# Altium schematic sheet buffers_5bits.SchDoc
size A4
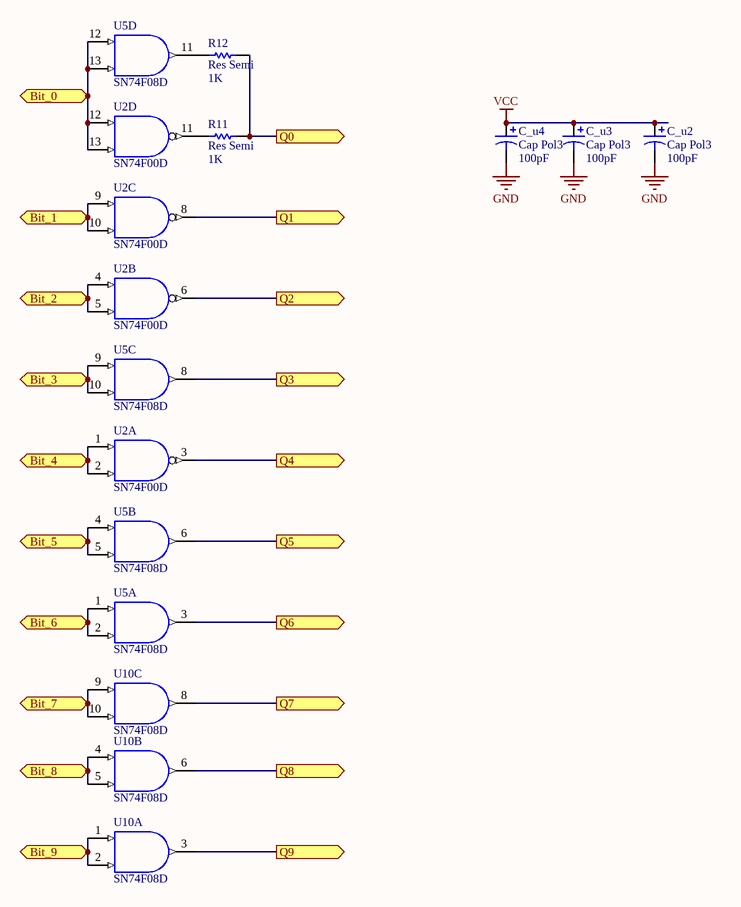
[diagram p0: buffers_5bits.SchDoc]

## Parts
C_u2  Cap Pol3  value 100pF  [C0805]
C_u3  Cap Pol3  value 100pF  [C0805]
C_u4  Cap Pol3  value 100pF  [C0805]
R11  Res Semi  value 1K  [2012[0805]]
R12  Res Semi  value 1K  [2012[0805]]
U2  SN74F00D  [D014_N]  (parts A,B,C,D of 4)
U5  SN74F08D  [D014_N]  (parts A,B,C,D of 4)
U10  SN74F08D  [D014_N]  (parts A,B,C of 4)

## Ports
Bit_0 (in), Bit_1 (in), Bit_2 (in), Bit_3 (in), Bit_4 (in), Bit_5 (in), Bit_6 (in), Bit_7 (in), Bit_8 (in), Bit_9 (in), Q0 (out), Q1 (out), Q2 (out), Q3 (out), Q4 (out), Q5 (out), Q6 (out), Q7 (out), Q8 (out), Q9 (out)

## Nets
GND: C_u2.2 C_u3.2 C_u4.2 U2.7(GND) U5.7(GND) U10.7(GND)
VCC: C_u2.1 C_u3.1 C_u4.1 U2.14(VCC) U5.14(VCC) U10.14(VCC)
Bit_0: U2.12(A) U2.13(B) U5.12(A) U5.13(B) ; port Bit_0
Bit_1: U2.9(A) U2.10(B) ; port Bit_1
Bit_2: U2.4(A) U2.5(B) ; port Bit_2
Bit_3: U5.9(A) U5.10(B) ; port Bit_3
Bit_4: U2.1(A) U2.2(B) ; port Bit_4
Bit_5: U5.4(A) U5.5(B) ; port Bit_5
Bit_6: U5.1(A) U5.2(B) ; port Bit_6
Bit_7: U10.9(A) U10.10(B) ; port Bit_7
Bit_8: U10.4(A) U10.5(B) ; port Bit_8
Bit_9: U10.1(A) U10.2(B) ; port Bit_9
Q0: R11.1 R12.1 ; port Q0
Q1: U2.8(Y) ; port Q1
Q2: U2.6(Y) ; port Q2
Q3: U5.8(Y) ; port Q3
Q4: U2.3(Y) ; port Q4
Q5: U5.6(Y) ; port Q5
Q6: U5.3(Y) ; port Q6
Q7: U10.8(Y) ; port Q7
Q8: U10.6(Y) ; port Q8
Q9: U10.3(Y) ; port Q9
NetR11_2: R11.2 U2.11(Y)
NetR12_2: R12.2 U5.11(Y)

## Library data of the parts
C_u2-C_u4 = Cap Pol3: Polarized Capacitor (Surface Mount); Published: 8-Jun-2000; LatestRevisionDate: 17-Jul-2002; LatestRevisionNote: Re-released for DXP Platform.; PackageReference: C0805; Publisher: Altium Limited
R11 R12 = Res Semi: Semiconductor Resistor; Published: 8-Jun-2000; LatestRevisionDate: 17-Jul-2002; LatestRevisionNote: Re-released for DXP Platform.; PackageReference: AXIAL-0.5; Publisher: Altium Limited
U2 = SN74F00D: Quadruple 2-Input Positive-NAND Gate; Published: 8-Jun-2000; LatestRevisionDate: 13-Apr-2006; LatestRevisionNote: IPC-7351 Footprint Added.; DatasheetVersion: Oct-1993; PackageVersion: Jan-1998; PackageReference: D014; Publisher: Altium Limited; PackageDescription: 14-Pin Small Outline Integrated Circuit 1.27 mm Pitch; Code_IPC: SOIC127P600-14; ComponentLink1Description: Manufacturer Link; ComponentLink1URL: http://www.ti.com/; ComponentLink2Description: Datasheet; ComponentLink2URL: http://www-s.ti.com/sc/ds/SN54F00.pdf
U5 U10 = SN74F08D: Quadruple 2-Input Positive-AND Gate; Published: 8-Jun-2000; LatestRevisionDate: 13-Apr-2006; LatestRevisionNote: IPC-7351 Footprint Added.; DatasheetVersion: Oct-1993; PackageVersion: Jan-1998; PackageReference: D014; Publisher: Altium Limited; PackageDescription: 14-Pin Small Outline Integrated Circuit 1.27 mm Pitch; Code_IPC: SOIC127P600-14; ComponentLink1Description: Manufacturer Link; ComponentLink1URL: http://www.ti.com/; ComponentLink2Description: Datasheet; ComponentLink2URL: http://www-s.ti.com/sc/ds/SN74F08.pdf